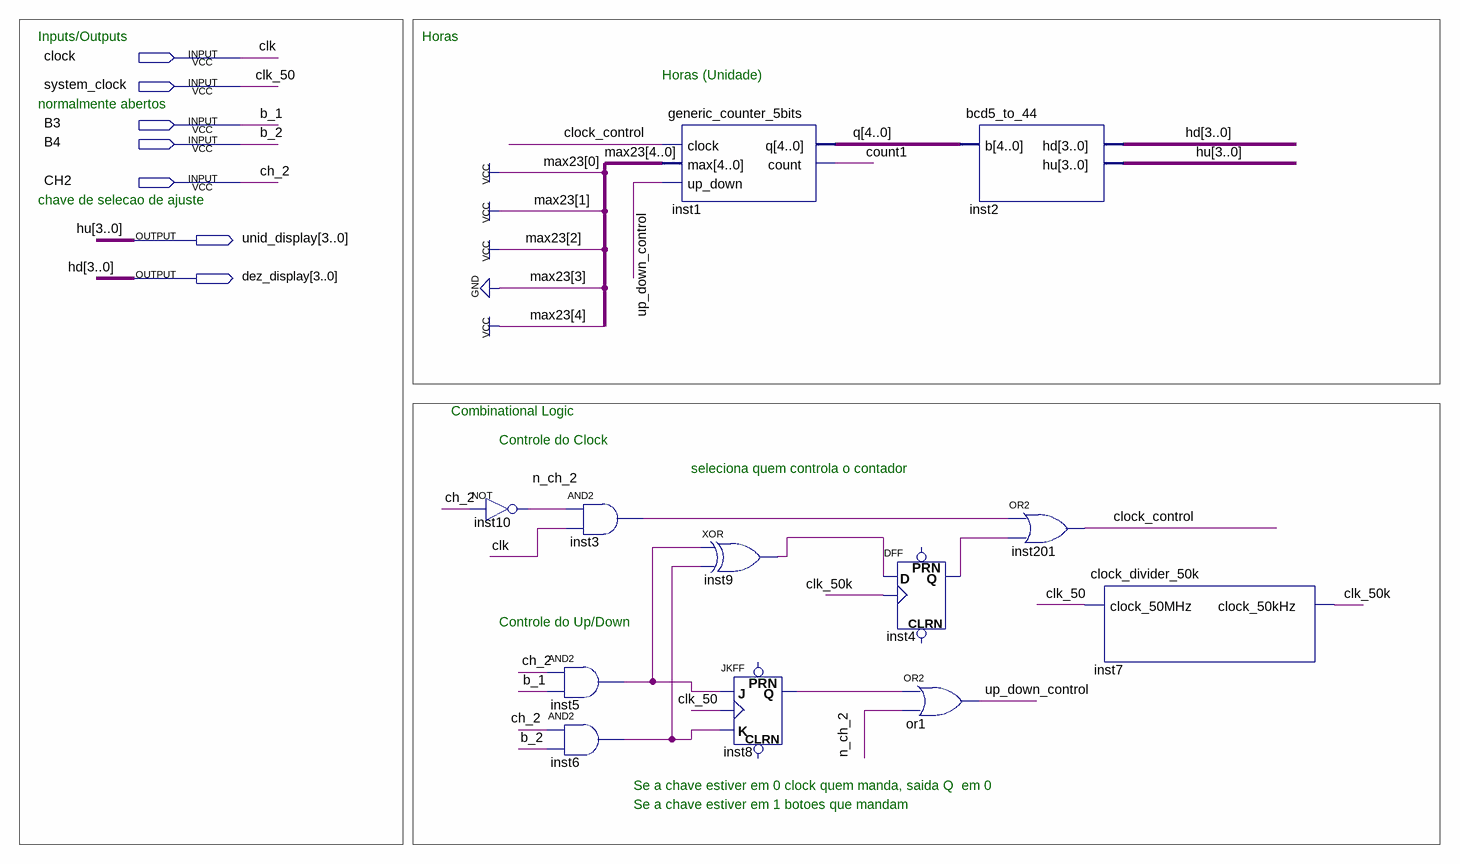
[diagram p0: schematic sheet]
// Quartus schematic hour_block.bdf as structural Verilog: 12 symbols, 7 pins
module hour_block (
  input  clock,
  input  system_clock,
  input  B3,
  input  B4,
  input  CH2,
  output [3:0] unid_display,
  output [3:0] dez_display
);

  wire clk_50k, clock_control, count1, inst3_out, inst4_q, inst5_out, inst6_out, inst8_q, inst9_out, n_ch_2,
       up_down_control;
  wire [4:0] q;

  not inst10 (n_ch_2, CH2);
  and inst3 (inst3_out, n_ch_2, clock);
  and inst5 (inst5_out, CH2, B3);
  and inst6 (inst6_out, CH2, B4);
  generic_counter_5bits inst1 (.clock(clock_control), .max(5'b10111), .up_down(up_down_control), .q(q), .count(count1));
  xor inst9 (inst9_out, inst5_out, inst6_out);
  JKFF inst8 (.K(inst6_out), .J(inst5_out), .CLK(system_clock), .Q(inst8_q));  // open: PRN, CLRN
  DFF inst4 (.CLK(clk_50k), .D(inst9_out), .Q(inst4_q));  // open: CLRN, PRN
  bcd5_to_44 inst2 (.b(q), .hd(dez_display), .hu(unid_display));
  or or1 (up_down_control, inst8_q, n_ch_2);
  or inst201 (clock_control, inst3_out, inst4_q);
  clock_divider_50k inst7 (.clock_50MHz(system_clock), .clock_50kHz(clk_50k));

  // Other names for the same wires on the sheet: b_1 = B3; b_2 = B4; ch_2 = CH2; clk = clock; clk_50 = system_clock;
  //   hd[3:0] = dez_display; hu[3:0] = unid_display

  // Notes on the sheet:
  //   Inputs/Outputs
  //   Horas
  //   Horas (Unidade)
  //   normalmente abertos
  //   chave de selecao de ajuste
  //   Combinational Logic
  //   Controle do Clock
  //   seleciona quem controla o contador
  //   Controle do Up/Down
  //   Se a chave estiver em 0 clock quem manda, saida Q  em 0
  //   Se a chave estiver em 1 botoes que mandam
endmodule
